# EAGLE schematic sensorNodev3 (EAGLE 7.2.0)
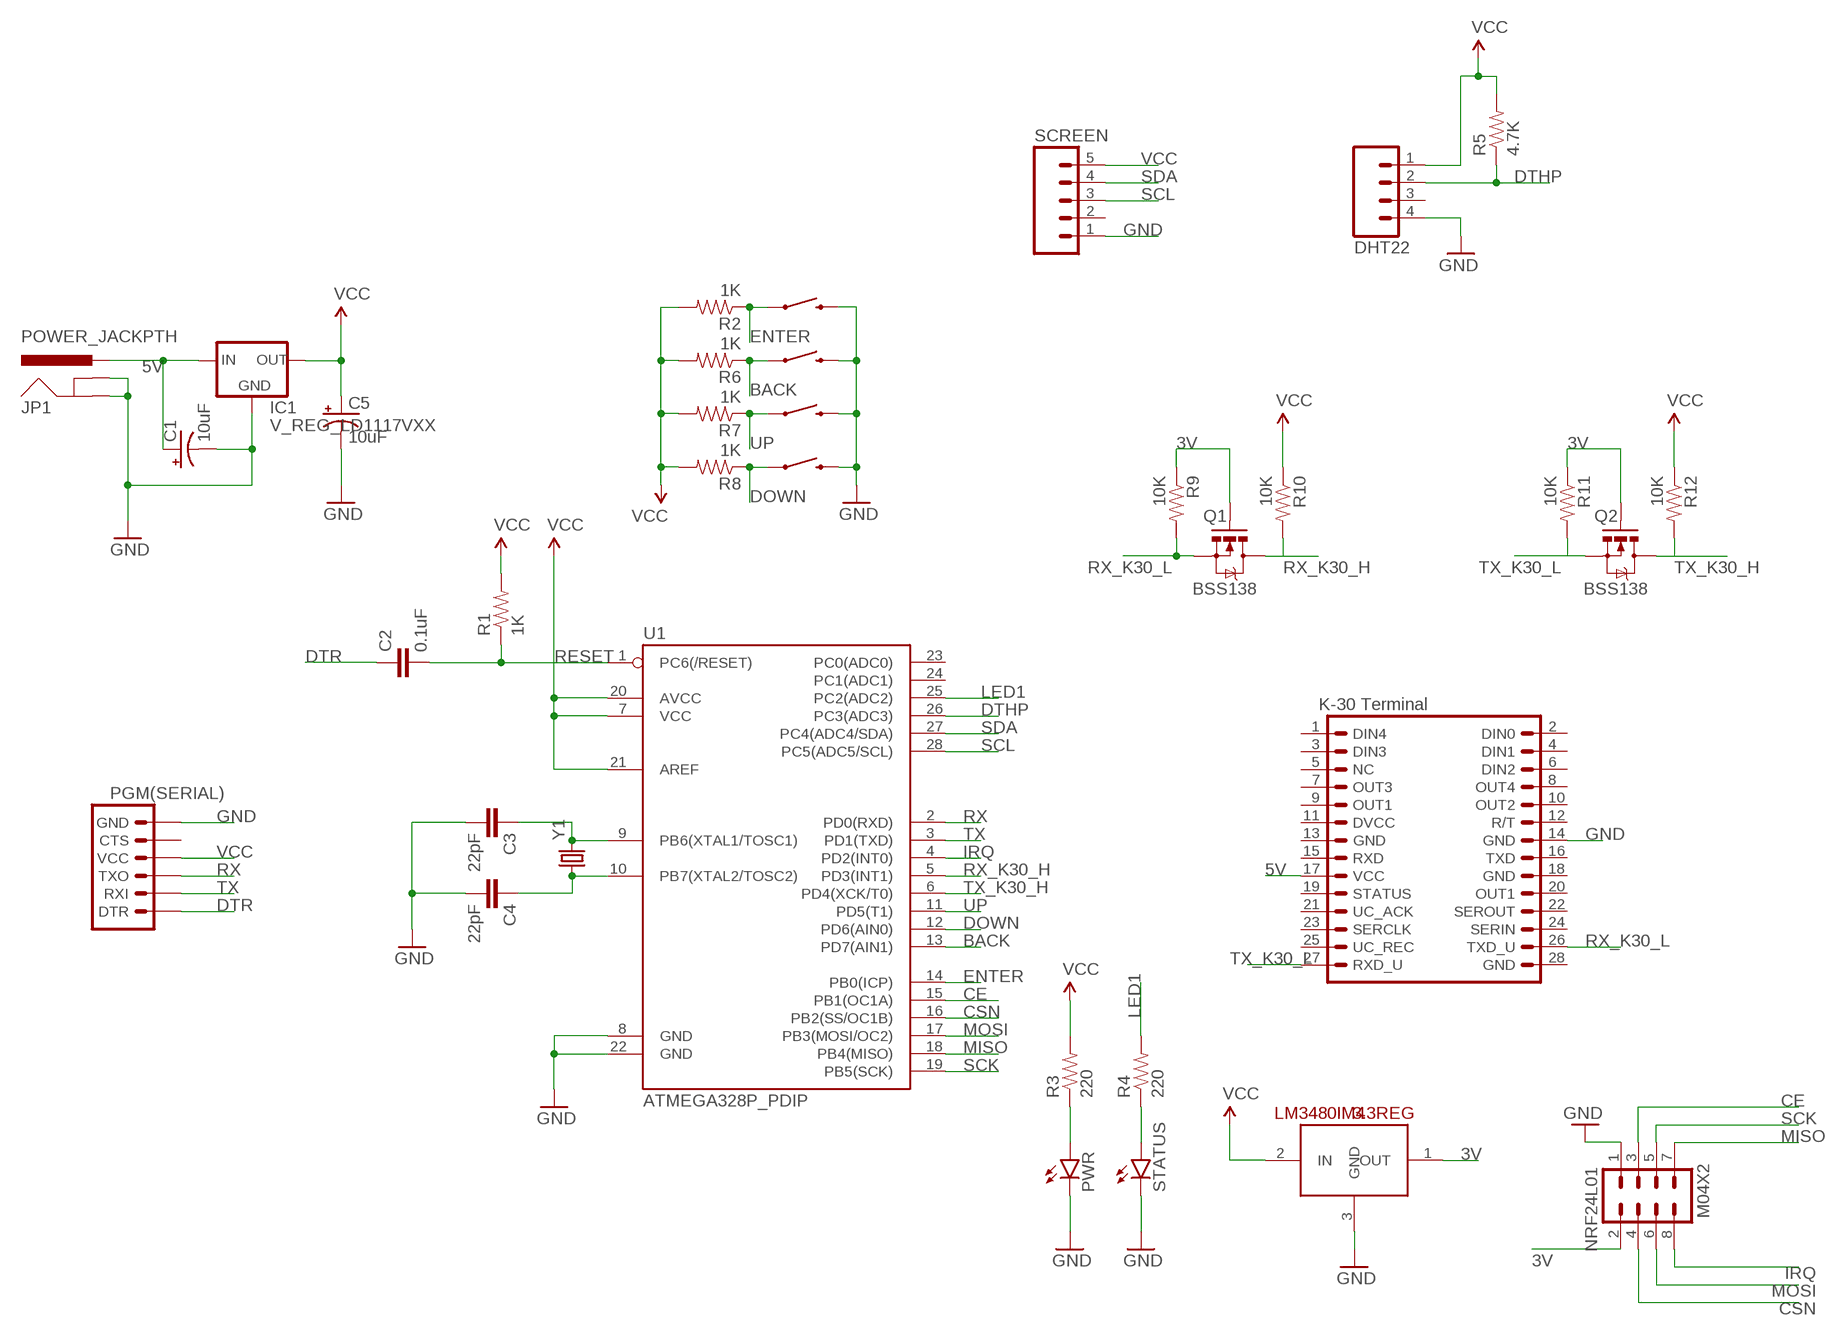
[diagram p0: schematic, sheet 1]

## Parts
3.3REG  LM3480IM4  [SOT23-3]
BACK  SWITCH-MOMENTARY-2PTH  [TACTILE-PTH]
C1  10uF  CAP_POLPTH2  [CPOL-RADIAL-10UF-25V]
C2  0.1uF  0.1UF-25V(+80/-20%)(0603)  [0603-CAP]
C3  22pF  22PF-50V-5%(0603)  [0603-CAP]
C4  22pF  22PF-50V-5%(0603)  [0603-CAP]
C5  10uF  CAP_POLPTH2  [CPOL-RADIAL-10UF-25V]
DHT22  M04PTH  [1X04]
DOWN  SWITCH-MOMENTARY-2PTH  [TACTILE-PTH]
ENTER  SWITCH-MOMENTARY-2PTH  [TACTILE-PTH]
IC1  V_REG_LD1117VXX  [78XXL]
JP1  POWER_JACKPTH  [POWER_JACK_PTH]
JP3  K-30K-30  [K-30]
NRF24L01  M04X2  [2X4]
PGM(SERIAL)  ARDUINO_SERIAL_PROGRAMPTH  [1X06]
PWR  LED0603  [LED-0603]
Q1  BSS138  MOSFET-NCHANNELSMD  [SOT23-3]
Q2  BSS138  MOSFET-NCHANNELSMD  [SOT23-3]
R1  1K  1KOHM-1/10W-1%(0603)  [0603-RES]
R2  1K  1KOHM-1/10W-1%(0603)  [0603-RES]
R3  220  1KOHM-1/10W-1%(0603)  [0603-RES]
R4  220  1KOHM-1/10W-1%(0603)  [0603-RES]
R5  4.7K  1KOHM-1/10W-1%(0603)  [0603-RES]
R6  1K  1KOHM-1/10W-1%(0603)  [0603-RES]
R7  1K  1KOHM-1/10W-1%(0603)  [0603-RES]
R8  1K  1KOHM-1/10W-1%(0603)  [0603-RES]
R9  10K  RESISTOR0603-RES  [0603-RES]
R10  10K  RESISTOR0603-RES  [0603-RES]
R11  10K  RESISTOR0603-RES  [0603-RES]
R12  10K  RESISTOR0603-RES  [0603-RES]
SCREEN  M05PTH  [1X05]
STATUS  LED0603  [LED-0603]
U1  ATMEGA328P_PDIP  [DIL28-3]
UP  SWITCH-MOMENTARY-2PTH  [TACTILE-PTH]
Y1  CRYSTALHC49US  [HC49US]

## Nets
3V: 3.3REG.1(OUT) NRF24L01.2 Q1.1(G) Q2.1(G) R9.1 R11.1
5V: C1.1(+) IC1.OUT(IN) JP1.PWR JP3.17(VCC)
BACK: BACK.1 R6.1 U1.13(PD7(AIN1))
CE: NRF24L01.3 U1.15(PB1(OC1A))
CSN: NRF24L01.4 U1.16(PB2(SS/OC1B))
DOWN: DOWN.1 R8.1 U1.12(PD6(AIN0))
DTHP: DHT22.2 R5.1 U1.26(PC3(ADC3))
DTR: C2.1 PGM(SERIAL).1(DTR)
ENTER: ENTER.1 R2.1 U1.14(PB0(ICP))
GND: 3.3REG.3(GND) BACK.3 C1.2(-) C3.2 C4.2 C5.2(-) DHT22.4 DOWN.3 ENTER.3 IC1.IN(GND) JP1.GND JP1.GNDBREAK JP3.14(GND) NRF24L01.1 PGM(SERIAL).6(GND) PWR.C SCREEN.1 STATUS.C U1.8(GND) U1.22(GND) UP.3
IRQ: NRF24L01.8 U1.4(PD2(INT0))
LED1: R4.2 U1.25(PC2(ADC2))
MISO: NRF24L01.7 U1.18(PB4(MISO))
MOSI: NRF24L01.6 U1.17(PB3(MOSI/OC2))
N$1: C3.1 U1.9(PB6(XTAL1/TOSC1)) Y1.2
N$2: C4.1 U1.10(PB7(XTAL2/TOSC2)) Y1.1
N$4: PWR.A R3.1
N$5: R4.1 STATUS.A
RESET: C2.2 R1.1 U1.1(PC6(/RESET))
RX: PGM(SERIAL).3(TXO) U1.2(PD0(RXD))
RX_K30_H: Q1.3(D) R10.2 U1.5(PD3(INT1))
RX_K30_L: JP3.26(TXD_U) Q1.2(S) R9.2
SCK: NRF24L01.5 U1.19(PB5(SCK))
SCL: SCREEN.3 U1.28(PC5(ADC5/SCL))
SDA: SCREEN.4 U1.27(PC4(ADC4/SDA))
TX: PGM(SERIAL).2(RXI) U1.3(PD1(TXD))
TX_K30_H: Q2.3(D) R12.2 U1.6(PD4(XCK/T0))
TX_K30_L: JP3.27(RXD_U) Q2.2(S) R11.2
UP: R7.1 U1.11(PD5(T1)) UP.1
VCC: 3.3REG.2(IN) C5.1(+) DHT22.1 IC1.GND(OUT) PGM(SERIAL).4(VCC) R1.2 R2.2 R3.2 R5.2 R6.2 R7.2 R8.2 R10.1 R12.1 SCREEN.5 U1.7(VCC) U1.20(AVCC) U1.21(AREF)
Unconnected: DHT22.3 JP3.1(DIN4) JP3.2(DIN0) JP3.3(DIN3) JP3.4(DIN1) JP3.5(NC) JP3.6(DIN2) JP3.7(OUT3) JP3.8(OUT4) JP3.9(OUT1) JP3.10(OUT2) JP3.11(DVCC) JP3.12(R/T) JP3.13(GND) JP3.15(RXD) JP3.16(TXD) JP3.18(GND) JP3.19(STATUS) JP3.20(OUT1) JP3.21(UC_ACK) JP3.22(SEROUT) JP3.23(SERCLK) JP3.24(SERIN) JP3.25(UC_REC) JP3.28(GND) PGM(SERIAL).5(CTS) SCREEN.2 U1.23(PC0(ADC0)) U1.24(PC1(ADC1))

## Library data of the parts
3.3REG = SparkFun-PowerIC:LM3480IM4: Small package linear regulator
BACK DOWN ENTER UP = SparkFun-Electromechanical:SWITCH-MOMENTARY-2: Various NO switches- pushbuttons, reed, etc
C1 C5 = SparkFun-Capacitors:CAP_POL: Capacitor Polarized These are standard SMD and PTH capacitors. Normally 10uF, 47uF, and 100uF in electrolytic and tantalum varieties. Always verify the external diameter of the through hole cap, it varies with capacity, voltage, and manufacturer. The EIA devices should be standard.
C2 = SparkFun-Capacitors:0.1UF-25V(+80/-20%)(0603): CAP-00810 Ceramic Standard decoupling cap; PROD_ID: CAP-00810
C3 C4 = SparkFun-Capacitors:22PF-50V-5%(0603): CAP-07876; PROD_ID: CAP-07876
DHT22 = SparkFun-Connectors:M04: Header 4 Standard 4-pin 0.1" header. Use with straight break away headers (SKU : PRT-00116), right angle break away headers (PRT-00553), swiss pins (PRT-00743), machine pins (PRT-00117), and female headers (PRT-00115). Molex polarized connector foot print use with SKU : PRT-08231 with associated crimp pins and housings. 1MM SMD Version SKU: PRT-10208
IC1 = SparkFun-PowerIC:V_REG_LD1117VXX: LD1117VXX voltage regulator. We carry the 3.3V version (COM-00526) in TO-220 package.
JP1 = SparkFun-Connectors:POWER_JACK: Power Jack This is the standard 5.5mm barrel jack for power. The PTH is the most common, proven, reliable, footprint. The Slot footprint only works if the mill layer is transmitted to the PCB fab house so be warned. Mating wall wart : TOL-00298 (and others); PROD_ID: CONN-08197
JP3 = misc:K-30: 0.1" spaced headers
NRF24L01 = SparkFun-Connectors:M04X2: .1" header, two rows of four.
PGM(SERIAL) = SparkFun-Connectors:ARDUINO_SERIAL_PROGRAM: FTDI connector footprints
PWR STATUS = SparkFun-LED:LED: LEDs Standard schematic elements and footprints for 5mm, 3mm, 1206, and 0603 sized LEDs. 5mm - Spark Fun Electronics SKU : COM-00529 (and others)
Q1 Q2 = SparkFun:MOSFET-NCHANNEL
R1 R2 R6-R8 = SparkFun-Resistors:1KOHM-1/10W-1%(0603): RES-07856; PROD_ID: RES-07856
R3-R5 = SparkFun-Resistors:1KOHM-1/10W-1%(0603): RES-07856; PROD_ID: RES-07856; VALUE: 1K
R9-R12 = SparkFun:RESISTOR: Resistor Basic schematic elements and footprints for 0603, 1206, and PTH resistors.
SCREEN = SparkFun-Connectors:M05: Header 5 Standard 5-pin 0.1" header. Use with straight break away headers (SKU : PRT-00116), right angle break away headers (PRT-00553), swiss pins (PRT-00743), machine pins (PRT-00117), and female headers (PRT-00115). Molex polarized connector foot print use with SKU : PRT-08230 with associated crimp pins and housings.
U1 = SparkFun-DigitalIC:ATMEGA328P_PDIP: uC used in the Arduino 32kb flash, 1k EEPROM, 2k SRAM This is the through-hole version of this chip.
Y1 = SparkFun-FreqCtrl:CRYSTAL: Various standard crystals. Proven footprints.